# EAGLE design PCB-DISP128x32 (EAGLE 7.7.0)

## Sheet 1 of 2
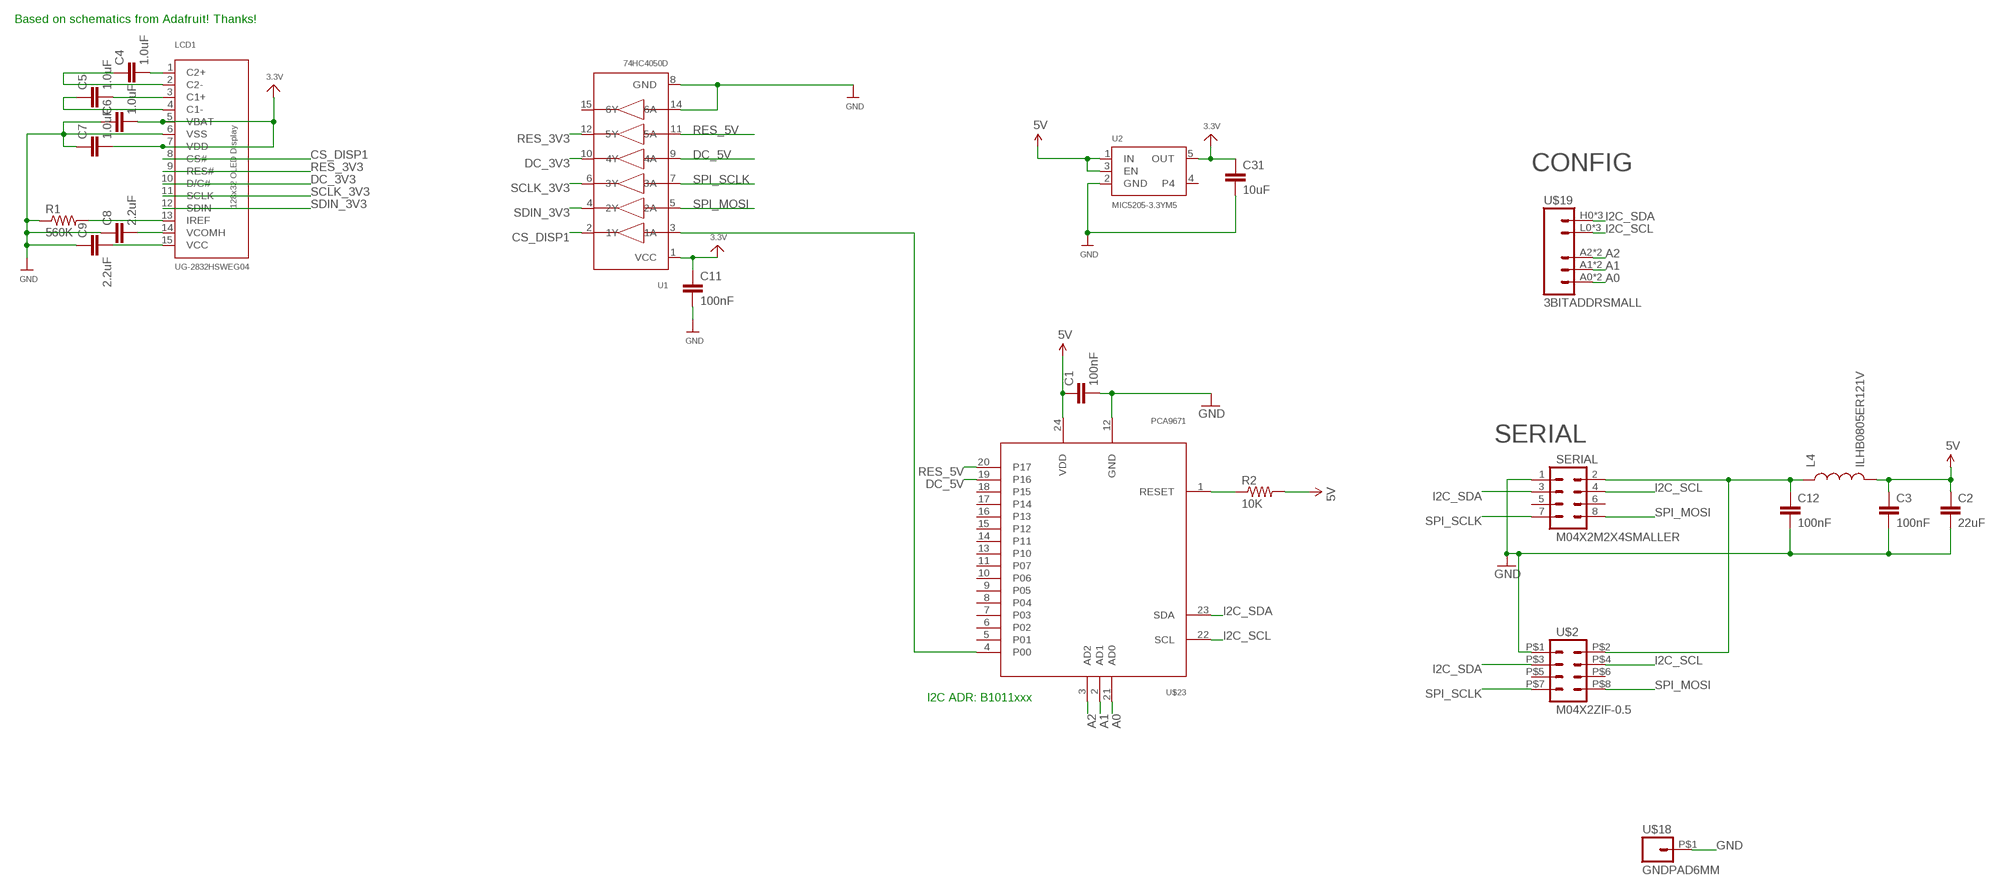
[diagram p0: schematic, sheet 1]

### Parts
C1  100nF  CAP0603-CAP  [0603-CAP]
C2  22uF  CAP0805  [0805]
C3  100nF  CAP0603-CAP  [0603-CAP]
C4  1.0uF  CAP0603-CAP  [0603-CAP]
C5  1.0uF  CAP0603-CAP  [0603-CAP]
C6  1.0uF  CAP0603-CAP  [0603-CAP]
C7  1.0uF  CAP0603-CAP  [0603-CAP]
C8  2.2uF  CAP0603-CAP  [0603-CAP]
C9  2.2uF  CAP0603-CAP  [0603-CAP]
C11  100nF  CAP0603-CAP  [0603-CAP]
C12  100nF  CAP0603-CAP  [0603-CAP]
C31  10uF  CAP0805  [0805]
L4  ILHB0805ER121V  INDUCTOR0805  [0805]
LCD1  UG-2832HSWEG04  OLED_UG-2832HSWEG04WRAPAROUND  [UG-2832HSWEG04_WRAPAROUND]
R1  560K  RESISTOR0603-RES  [0603-RES]
R2  10K  RESISTOR0603-RES  [0603-RES]
SERIAL  M04X2M2X4SMALLER  [M2X4SMALLER]
U1  74HC4050D  74HC4050DTSSOP16  [TSSOP16]
U2  MIC5205-3.3YM5  VREG_SOT23-5  [SOT23-5]
U$2  M04X2ZIF-0.5  [ZIP-8-0.5]
U$18  GNDPAD6MM  [3.2MMPAD6MM]
U$19  3BITADDRSMALL  [3BITADDR_SMALL]
U$23  PCA9671  [TSSOP24]

### Nets
3.3V [Power]: C6.2 C7.2 C11.1 C31.1 LCD1.5(VBAT) LCD1.7(VDD) U1.1(VCC) U2.5(OUT)
5V [Power]: C1.1 C2.1 C3.1 L4.2 R2.2 U2.1(IN) U2.3(EN) U$23.24(VDD)
A0: U$19.A0 U$19.AS0(A0) U$23.21(AD0)
A1: U$19.A1 U$19.AS1(A1) U$23.2(AD1)
A2: U$19.A2 U$19.AS2(A2) U$23.3(AD2)
ARD_5V [Power]: C12.1 L4.1 SERIAL.2 U$2.P$2
CS_DISP1: LCD1.8(CS#) U1.2(1Y)
DC_3V3: LCD1.10(D/C#) U1.10(4Y)
DC_5V: U1.9(4A) U$23.19(P16)
GND [Power]: C1.2 C2.2 C3.2 C6.1 C7.1 C8.1 C9.1 C11.2 C12.2 C31.2 LCD1.6(VSS) R1.1 SERIAL.1 U1.8(GND) U1.14(6A) U2.2(GND) U$2.P$1 U$18.P$1 U$23.12(GND)
I2C_SCL: SERIAL.4 U$2.P$4 U$19.L0(GND) U$19.L1(GND) U$19.L2(GND) U$23.22(SCL)
I2C_SDA: SERIAL.3 U$2.P$3 U$19.H0(VCC) U$19.H1(VCC) U$19.H2(VCC) U$23.23(SDA)
N$1: R2.1 U$23.1(RESET)
N$2: C4.1 LCD1.2(C2-)
N$3: C4.2 LCD1.1(C2+)
N$4: C5.1 LCD1.4(C1-)
N$5 [Power]: U1.3(1A) U$23.4(P00)
N$7: C5.2 LCD1.3(C1+)
N$8: LCD1.13(IREF) R1.2
N$9: C8.2 LCD1.14(VCOMH)
N$28: C9.2 LCD1.15(VCC)
RES_3V3: LCD1.9(RES#) U1.12(5Y)
RES_5V: U1.11(5A) U$23.20(P17)
SCLK_3V3: LCD1.11(SCLK) U1.6(3Y)
SDIN_3V3: LCD1.12(SDIN) U1.4(2Y)
SPI_MOSI: SERIAL.8 U1.5(2A) U$2.P$8
SPI_SCLK: SERIAL.7 U1.7(3A) U$2.P$7
Unconnected: SERIAL.5 SERIAL.6 U1.15(6Y) U2.4 U$2.P$5 U$2.P$6 U$23.5(P01) U$23.6(P02) U$23.7(P03) U$23.8(P04) U$23.9(P05) U$23.10(P06) U$23.11(P07) U$23.13(P10) U$23.14(P11) U$23.15(P12) U$23.16(P13) U$23.17(P14) U$23.18(P15)

### Notes on the sheet
- Based on schematics from Adafruit! Thanks!
- CONFIG
- SERIAL
- I2C ADR: B1011xxx

## Sheet 2 of 2

## Library data of the parts
C1-C9 C11 C12 C31 = SparkFun:CAP: Capacitor Standard 0603 ceramic capacitor, and 0.1" leaded capacitor.
L4 = SparkFun:INDUCTOR: Inductors Basic Inductor/Choke - 0603 and 1206. Footprints are not proven and vary greatly between part numbers.
LCD1 = microbuilder:OLED_UG-2832HSWEG04: 128x32 SPI 0.91" Monochrome OLED Display
R1 R2 = SparkFun:RESISTOR: Resistor Basic schematic elements and footprints for 0603, 1206, and PTH resistors.
SERIAL U$2 = SKAARHOJ:M04X2
U1 = SKAARHOJ:74HC4050D: 6-channel level shifter 74HC4050D - 2V-6V Supply Digikey: 74HC4050D,653-ND Mouser: 771-74HC4050D-T
U2 = microbuilder:VREG_SOT23-5: SOT23-5 Fixed Voltage Regulators To better organise some of the SOT23-5 fixed voltage regulators in this library, this new part was created. Part Current Out V Out V In V Dropout Digikey Part No. ADP121 150mA 3.3V 3.4-5.5V 0.09V @ 150mA ADP121-AUJZ33R7CT-ND ADP121 150mA 3.0V 3.1-5.5V 0.09V @ 150mA ADP121-AUJZ30R7CT-ND ADP122 300mA 3.3V 3.4-5.5V 0.085V @ 300mA ADP122AUJZ-3.3-R7CT-ND ADP1712 300mA 3.3V 3.5-5.5V 0.17V @ 300mA ADP1712AUJZ-3.3-R7TR-ND AP7311 (Low Cost) 150mA 3.3V 3.5-6V 0.15V @ 150mA AP7311-33WG-7DICT-ND LD39015M18R 150mA 1.8V 1.9V-5.5V 0.08V @ 100mA 497-6977-1-ND MCP1824T-3302E/OT 300mA 3.3V 3.5V-6V 0.2V @ 300mA MCP1824T-3302E/OTCT-ND MIC5205-2.5YM5 TR 150mA 2.5V 2.7-16V 0.165V @ 150mA 576-1257-2-ND MIC5205-3.0YM5 TR 150mA 3.0V 3.2V-16V 0.165V @ 150mA 576-1258-2-ND MIC5205-3.3YM5 TR 150mA 3.3V 3.5V-16V 0.165V @ 150mA 576-1259-2-ND TPS780330220 150mA 3.3V+2.2V 3.6-5.5V 250mV Max 296-23332-1-ND TDA3663/N1,135 100mA 3.3V 3.5-45V 0.18V @ 50mA 568-5343-1-ND
U$18 = SKAARHOJ:GNDPAD
U$19 = SKAARHOJ:3BITADDR
U$23 = SKAARHOJ:PCA9671

## Net classes
0 default: width 0.203 mm, drill 0.406 mm, clearance 0.152 mm
1 Power: width 0.406 mm, drill 0.61 mm, clearance 0.203 mm

## Board
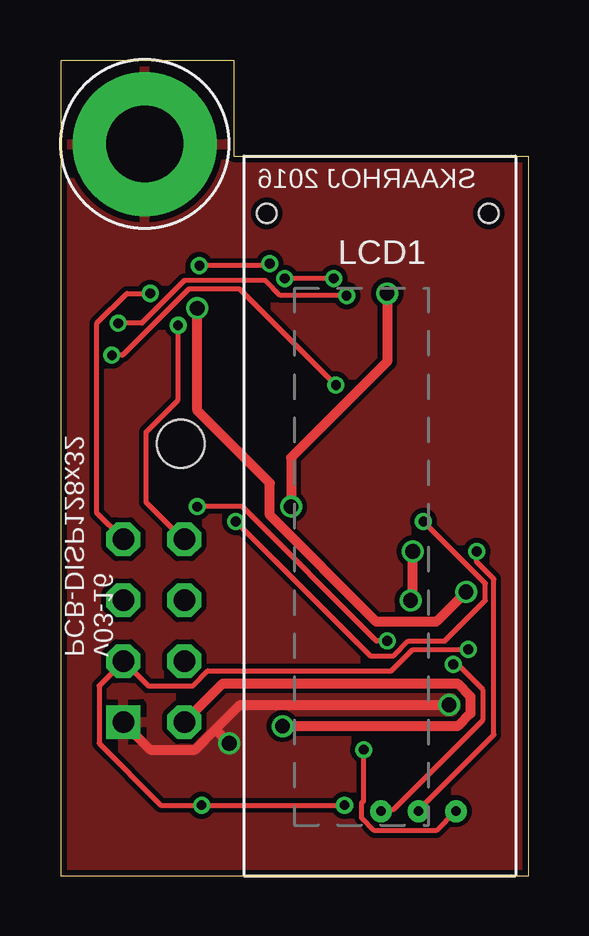
[diagram p1: board, top side]
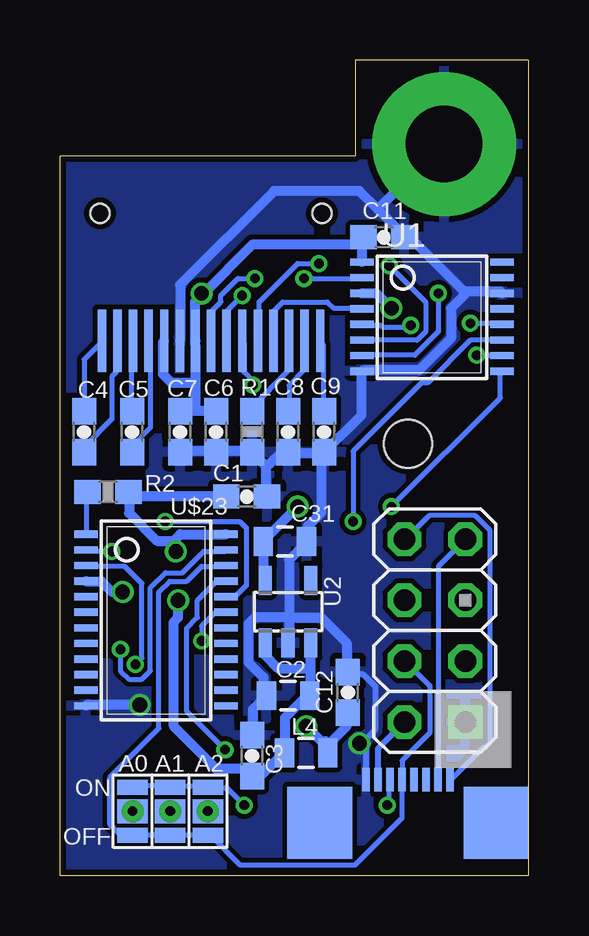
[diagram p2: board, bottom side, seen from below]

Size 19.5 x 34 mm. Coordinates in mm from the lower left corner, seen from the top.
Outline: 19.5,0 19.5,30 7.21,30 7.21,34 0,34 0,0 19.5,0
Copper layers (1*16): Top 0.035mm / dielectric 1.5mm / Bottom 0.035mm
Design rules "Fusion_eagle_rule_v1.1": minimum track width 6mil, minimum drill 12mil, track to track 6mil, track to pad 6mil, pad to pad 6mil, via to via 6mil, smd to smd 0mil, copper to edge 10mil, drill to drill 10mil, minimum pad ring 10mil, minimum via ring 6mil, stop-mask expansion 2mil, vias tented up to drill 100mil, thermal gap 10mil
Holes 2 mm at 5,18

### Footprints (pad centres in the part's own frame; a part is rotated, then mirrored left to right if it is on the bottom)
0603-CAP = smd 1.1 x 1: 1 -0.85,0; 2 0.85,0
0805 = smd 0.8 x 1.2: 1 -0.9,0; 2 0.9,0
UG-2832HSWEG04_WRAPAROUND = smd 2.6 x 0.35 bottom: 1 -7.7,-4.55; 2 -7.7,-3.9; 3 -7.7,-3.25; 4 -7.7,-2.6; 5 -7.7,-1.95; 6 -7.7,-1.3; 7 -7.7,-0.65; 8 -7.7,0; 9 -7.7,0.65; 10 -7.7,1.3; 11 -7.7,1.95; 12 -7.7,2.6; 13 -7.7,3.25; 14 -7.7,3.9; 15 -7.7,4.55 | hole 0.8: -2.4,4.625; -2.4,-4.625
0603-RES = smd 1.1 x 1: 1 -0.85,0; 2 0.85,0
M2X4SMALLER = drill 0.9 square: 1 -1.27,3.81 | drill 0.9 octagon: 2 1.27,3.81; 3 -1.27,1.27; 4 1.27,1.27; 5 -1.27,-1.27; 6 1.27,-1.27; 7 -1.27,-3.81; 8 1.27,-3.81
TSSOP16 = smd 0.305 x 0.991: 1 -3.575,-2.918; 2 -2.925,-2.918; 3 -2.275,-2.918; 4 -1.625,-2.918; 5 -0.975,-2.918; 6 -0.325,-2.918; 7 0.325,-2.918; 8 0.975,-2.918; 9 0.975,2.918; 10 0.325,2.918; 11 -0.325,2.918; 12 -0.975,2.918; 13 -1.625,2.918; 14 -2.275,2.918; 15 -2.925,2.918; 16 -3.575,2.918
SOT23-5 = smd 0.55 x 1.2: 1 -0.95,-1.3; 2 0,-1.3; 3 0.95,-1.3; 4 0.95,1.3; 5 -0.95,1.3
ZIP-8-0.5 = smd 2.7 x 3: GND$1 3.68,-1.8; GND$9 -3.68,-1.8 | smd 0.3 x 0.96: P$1 -1.75,0; P$2 -1.25,0; P$3 -0.75,0; P$4 -0.25,0; P$5 0.25,0; P$6 0.75,0; P$7 1.25,0; P$8 1.75,0
3.2MMPAD6MM = drill 3.2 pad 6: P$1 0,0
3BITADDR_SMALL = drill 0.4: A0 -1.565,0; A1 0,0; A2 1.565,0 | smd 1.27 x 1: AS0 -1.565,0; AS1 0,0; AS2 1.565,0 | smd 1.27 x 0.635: H0 -1.565,1; H1 0,1; H2 1.565,1; L0 -1.565,-1; L1 0,-1; L2 1.565,-1
TSSOP24 = smd 0.305 x 0.991: 1 -4.225,-2.918; 2 -3.575,-2.918; 3 -2.925,-2.918; 4 -2.275,-2.918; 5 -1.625,-2.918; 6 -0.975,-2.918; 7 -0.325,-2.918; 8 0.325,-2.918; 9 0.975,-2.918; 10 1.625,-2.918; 11 2.275,-2.918; 12 2.925,-2.918; 13 2.925,2.918; 14 2.275,2.918; 15 1.625,2.918; 16 0.975,2.918; 17 0.325,2.918; 18 -0.325,2.918; 19 -0.975,2.918; 20 -1.625,2.918; 21 -2.275,2.918; 22 -2.925,2.918; 23 -3.575,2.918; 24 -4.225,2.918

### Placement (x,y rotation side)
C1  11.72,15.8 0 bottom
C2  10,7.5 180 bottom
C3  11.5,5 90 bottom
C4  18.5,18.5 90 bottom
C5  16.5,18.5 90 bottom
C6  13,18.5 90 bottom
C7  14.5,18.5 90 bottom
C8  10,18.5 90 bottom
C9  8.5,18.5 90 bottom
C11  6,26.61 0 bottom
C12  7.51,7.63 90 bottom
C31  10.13,13.92 0 bottom
L4  9.25,5.12 180 bottom
LCD1  13.21,30 90 top
R1  11.5,18.5 90 bottom
R2  17.5,16 0 bottom
SERIAL  3.88,10.21 180 bottom
U1  4,22 270 bottom
U2  10,11 0 bottom
U$2  5,4 0 bottom
U$18  3.5,30.5 0 top
U$19  14.91,2.68 0 bottom
U$23  15.5,10 270 bottom

### Tracks (layer width: path | path; a pad name or v marks a point on that pad's centre or on a via)
3.3V  (via drill 0.61)
  Top 0.406: v9.6,15.38 9.6,17.42 13.6,21.43 v13.6,24.27
  Bottom 0.406: U2.5 11.02,12.36 11.02,13.87 C31.1 10.94,14.05 v9.6,15.38 | 13.87,19.38 14.49,19.38 C7.2 | 13.87,19.38 13.07,19.38 C6.2 | U1.1 6.93,25.6 6.93,26.58 C11.1 7.11,26.31 11.47,26.31 13.56,24.23 | 13.56,24.23 13.87,23.91 13.87,22.31 LCD1.7 13.87,22.14 13.87,20.54 | 13.87,20.54 13.87,19.38 | v13.6,24.27 13.56,24.23 | 13.87,20.54 14.85,20.54 15.2,20.89 15.2,22.23 LCD1.5
5V  (via drill 0.61)
  Top 0.406: v14.67,13.51 14.67,11.56 v14.58,11.47
  Bottom 0.406: 14.76,13.96 14.49,14.22 12.62,14.22 U$23.24 | 14.76,13.96 15.47,13.96 16.62,15.11 16.62,15.91 R2.2 16.45,15.82 12.62,15.82 C1.1 | 9.07,8.62 9.07,9.69 U2.3 | 9.07,8.62 9.07,7.56 C2.1 9.25,7.47 10.13,6.58 10.13,5.25 L4.2 10.22,5.07 11.11,4.18 11.47,4.18 C3.1 11.65,4.27 11.82,4.45 12.98,4.45 14.76,6.22 14.76,10.58 14.58,10.76 v14.58,11.47 | 9.07,8.62 10.4,8.62 10.94,9.16 10.94,9.69 U2.1 | v14.67,13.51 14.67,13.78 14.76,13.96
A0  (via drill 0.41)
  Top 0.203: v12.62,5.25 12.62,3.11 12.54,3.02 12.54,2.4 13.07,1.87 15.65,1.87 16.45,2.67 U$19.AS0
  Bottom 0.203: v12.62,5.25 14.22,6.84 14.22,10.31 13.78,10.76 13.78,11.47 12.98,12.27 12.62,12.27 U$23.21 | 16.54,2.67 U$19.AS0
A1  (via drill 0.41)
  Top 0.203: v17.34,13.51 17.34,13.07 18.05,12.36 18.05,5.87 14.94,2.76 U$19.AS1
  Bottom 0.203: v17.34,13.51 18.4,13.51 U$23.2 | 14.94,2.67 U$19.AS1
A2  (via drill 0.41)
  Top 0.203: v16.36,8.8 16.54,8.8 17.6,7.73 17.6,6.49 13.87,2.76 13.42,2.76 U$19.AS2
  Bottom 0.203: v16.36,8.8 16.09,9.07 16.09,12.18 16.8,12.89 18.4,12.89 U$23.3 | 13.34,2.67 U$19.AS2
ARD_5V  (via drill 0.61)
  Top 0.406: v9.25,6.22 16.54,6.22 17.07,6.76 17.07,7.47 16.54,8 6.76,8 SERIAL.2
  Bottom 0.254: U$2.P$2 6.25,5.3 SERIAL.2
  Bottom 0.406: C12.1 7.56,6.76 7.56,6.22 8.27,5.51 8.27,5.16 L4.1 8.45,5.6 8.62,5.6 v9.25,6.22
CS_DISP1  (via drill 0.41)
  Top 0.203: v11.38,24.89 v9.34,24.89
  Bottom 0.203: v9.34,24.89 6.93,24.89 U1.2 | v11.38,24.89 12.09,24.89 12.8,24.18 12.8,23.91 13.16,23.56 13.16,22.31 LCD1.8
DC_3V3  (via drill 0.41)
  Top 0.203: v2.13,21.69 2.58,21.69 5.33,24.45 7.47,24.45 v11.47,20.45
  Bottom 0.203: v2.13,21.69 1.16,21.69 U1.10 | v11.47,20.45 11.47,20.62 11.82,20.98 11.82,22.23 LCD1.10
DC_5V  (via drill 0.41)
  Top 0.203: v5.69,15.38 7.56,15.38 13.16,9.78 v13.6,9.78
  Bottom 0.203: v5.69,15.38 1.16,19.91 1.16,20.98 U1.9 | v13.6,9.78 13.6,10.4 13.07,10.94 12.62,10.94 U$23.19
GND  (via drill 0.61)
  Top 0.406: v16.18,7.11 7.47,7.11 6.45,6.09 | 6.45,6.09 5.6,5.25 3.73,5.25 2.67,6.31 SERIAL.1 | v7.02,5.51 6.45,6.09
  Bottom 0.254: U$2.P$1 6.75,5.51 6.75,5.7 6.35,6.1 6.35,7.87 6.86,8.38 7.41,8.38 C12.2
  Bottom 0.406: v16.18,7.11 18.4,7.11 U$23.12 | 10.94,17.07 10.94,15.82 C1.2 | 10.94,17.07 11.47,17.6 R1.1 11.65,17.69 12.98,17.69 C6.1 13.16,17.69 14.49,17.69 C7.1 | 10.94,17.07 10.76,17.16 10.31,17.6 10.05,17.6 C8.1 9.87,17.6 8.8,17.6 C9.1 | C3.2 11.47,5.87 11.47,6.93 10.94,7.47 C2.2 11.02,7.64 11.02,8.27 11.65,8.89 11.65,10.49 11.38,10.76 9.96,10.76 | C9.1 8.45,17.69 6.93,19.2 6.93,20.98 U1.8 6.76,21.07 4.53,21.07 3.2,22.4 3.2,23.65 2.67,24.18 2.67,24.36 | C9.1 8.62,17.51 8.62,15.11 9.16,14.58 9.16,13.96 C31.2 9.34,13.78 9.96,13.16 9.96,10.76 | 9.96,10.76 9.96,9.78 U2.2 | 9.96,10.76 8.62,10.76 7.56,9.69 7.56,8.53 C12.2 | 6.75,5.51 v7.02,5.51 | 2.67,24.36 1.16,24.36 U1.14 | 2.67,24.36 4.89,26.58 5.07,26.58 C11.2 5.25,26.76 6.27,27.78 | 6.27,27.78 7.02,28.54 10.58,28.54 14.49,24.62 14.49,22.31 LCD1.6 | 6.27,27.78 3.56,30.49 U$18.P$1
  pour Top: 0,0 20,0 20,34 0,34
  pour Bottom: 0,0 20,0 20,34 0,34
I2C_SCL
  Bottom 0.203: SERIAL.4 5.07,8.89 4.09,7.91 4.09,5.96 5.25,4.8 U$2.P$4 5.25,3.91 5.25,2.4 7.2,0.45 12,0.45 13.25,1.69 U$19.L2 13.42,1.69 14.85,1.69 U$19.L1 14.94,1.69 16.45,1.69 U$19.L0 16.54,1.69 16.98,1.69 17.42,2.13 17.42,4.09 15.38,6.13 15.38,11.82 14.94,12.27 14.22,12.27 13.6,12.89 12.62,12.89 U$23.22
I2C_SDA  (via drill 0.41)
  Top 0.203: v16.98,9.42 14.67,9.42 13.78,8.53 6.13,8.53 5.51,7.91 3.65,7.91 2.67,8.89 SERIAL.3 2.58,8.89 1.6,7.91 1.6,5.51 4.18,2.93 v5.87,2.93 v11.82,2.93
  Bottom 0.203: U$19.H0 16.45,3.73 14.94,3.73 U$19.H1 14.85,3.73 13.42,3.73 U$19.H2 13.25,3.65 12.54,3.65 v11.82,2.93 | v5.87,2.93 5.78,3.02 5.78,3.91 U$2.P$3 | v16.98,9.42 16.98,8.53 16.62,8.18 16.09,8.18 15.73,8.53 15.73,12 15.11,12.62 14.4,12.62 13.51,13.51 12.62,13.51 U$23.23
N$1
  Bottom 0.203: U$23.1 18.4,14.31 18.4,15.91 R2.1
N$2
  Bottom 0.203: C4.1 18.49,17.69 18.49,17.87 17.34,19.02 17.34,20.8 17.16,20.98 17.16,22.23 LCD1.2
N$3
  Bottom 0.203: C4.2 18.49,19.38 18.49,21.51 17.78,22.23 LCD1.1
N$4
  Bottom 0.203: C5.1 16.45,17.69 16.45,17.96 15.73,18.67 15.73,22.23 LCD1.4
N$5  (via drill 0.61)
  Top 0.406: v5.69,23.65 5.69,19.38 8.71,16.36 8.71,15.02 13.16,10.58 15.65,10.58 v16.89,11.82
  Bottom 0.406: v5.69,23.65 6.31,24.27 6.84,24.27 U1.3 | v16.89,11.82 17.34,11.82 17.78,12.27 18.4,12.27 U$23.4
N$7
  Bottom 0.203: C5.2 16.54,19.38 16.54,22.23 LCD1.3
N$8
  Bottom 0.203: R1.2 11.47,19.38 11.47,19.56 10.05,20.98 10.05,22.23 LCD1.13
N$9
  Bottom 0.203: C8.2 9.96,19.38 9.96,20.45 9.34,21.07 9.34,22.23 LCD1.14
N$28
  Bottom 0.203: C9.2 8.53,19.38 8.53,22.14 8.62,22.23 LCD1.15
RES_3V3  (via drill 0.41)
  Top 0.203: v2.4,23.02 3.38,23.02 5.16,24.8 8.53,24.8 9.16,24.18 v11.91,24.18
  Bottom 0.203: v2.4,23.02 1.16,23.02 U1.12 | v11.91,24.18 12.54,23.56 12.54,22.31 LCD1.9
RES_5V  (via drill 0.41)
  Top 0.203: v15.11,14.76 17.69,12.18 17.69,11.47 16,9.78 14.49,9.78 13.87,9.16 12.89,9.16 v7.29,14.76
  Bottom 0.203: v15.11,14.76 12,14.76 11.73,14.49 11.73,12.09 12.18,11.65 12.54,11.65 U$23.20 | v7.29,14.76 7.29,17.69 4.45,20.54 4.18,20.54 2.4,22.31 1.16,22.31 U1.11
SCLK_3V3  (via drill 0.41)
  Top 0.203: v5.78,25.43 8.62,25.43 v8.71,25.51
  Bottom 0.203: v5.78,25.43 4.27,23.91 4.27,22.67 4.62,22.31 6.84,22.31 U1.6 | v8.71,25.51 9.6,25.51 11.2,23.91 11.2,22.31 LCD1.11
SDIN_3V3
  Bottom 0.203: U1.4 6.93,23.65 8.09,23.65 8.36,23.91 10.22,23.91 10.58,23.56 10.58,22.31 LCD1.12
SPI_MOSI  (via drill 0.41)
  Top 0.203: v4.89,22.94 4.89,19.82 3.56,18.49 3.56,15.56 5.07,14.05 SERIAL.8
  Bottom 0.203: U$2.P$8 3.2,4 1.87,5.33 1.78,5.33 1.6,5.51 1.6,14.4 2.22,15.02 4.09,15.02 5.07,14.05 SERIAL.8 | v4.89,22.94 4.98,22.85 6.04,22.85 6.13,22.94 6.84,22.94 U1.5
SPI_SCLK  (via drill 0.41)
  Top 0.203: v3.73,24.27 2.76,24.27 1.51,23.02 1.51,15.11 2.58,14.05 SERIAL.7
  Bottom 0.203: U$2.P$7 3.73,4 3.73,12.89 2.67,13.96 SERIAL.7 | v3.73,24.27 3.73,22.67 4.71,21.69 6.84,21.69 U1.7

### Text on the board
_tsilk: SKAARHOJ 2016 | v03-16 / PCB-DISP128x32